# Altium schematic sheet MeteoStationNucleo.SchDoc
size A4
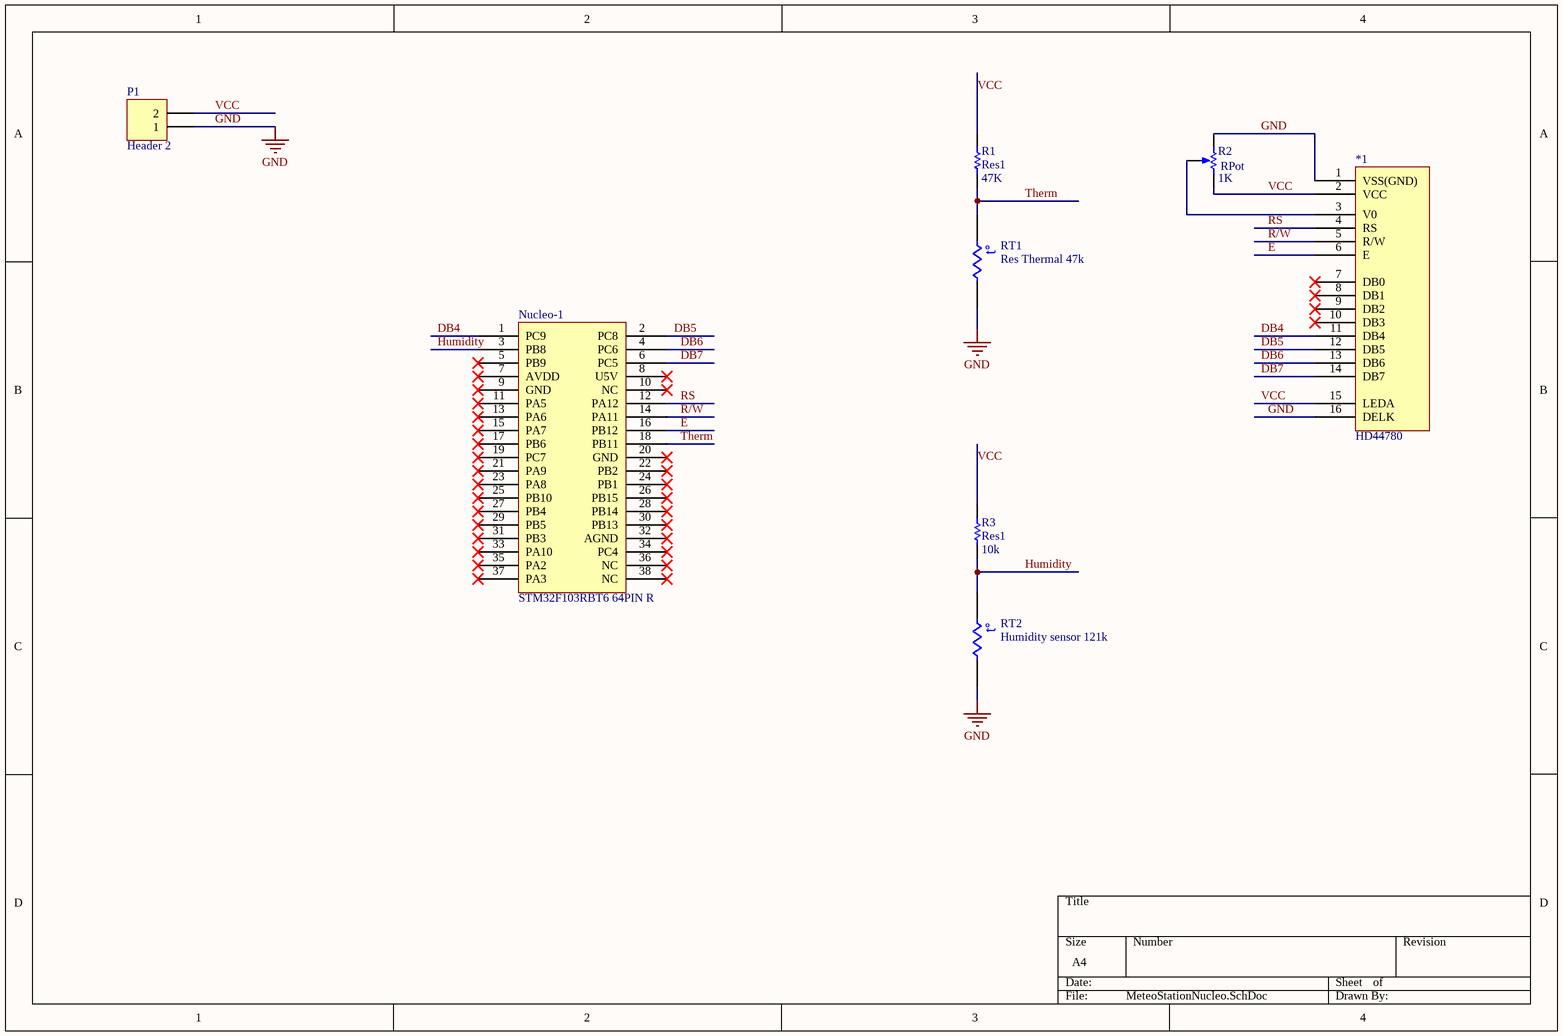
[diagram p0: MeteoStationNucleo.SchDoc]

## Parts
*1  HD44780
Nucleo-1  STM32F103RBT6 64PIN R
P1  Header 2  [HDR1X2]
R1  Res1  value 47K  [AXIAL-0.3]
R2  RPot  value 1K  [VR5]
R3  Res1  value 10k  [AXIAL-0.3]
RT1  Res Thermal 47k  [6-0805_N]
RT2  Humidity sensor 121k  [6-0805_N]

## Nets
GND: *1.1(VSS(GND)) *1.16(DELK) P1.1 R2.1(TOP) RT1.2 RT2.2
DB4: *1.11(DB4) Nucleo-1.1(PC9)
DB5: *1.12(DB5) Nucleo-1.2(PC8)
DB6: *1.13(DB6) Nucleo-1.4(PC6)
DB7: *1.14(DB7) Nucleo-1.6(PC5)
E: *1.6(E) Nucleo-1.16(PB12)
Humidity: Nucleo-1.3(PB8) R3.1 RT2.1
R/W: *1.5(R/W) Nucleo-1.14(PA11)
RS: *1.4(RS) Nucleo-1.12(PA12)
Therm: Nucleo-1.18(PB11) R1.1 RT1.1
VCC: *1.2(VCC) *1.15(LEDA) P1.2 R1.2 R2.2(BOT) R3.2
Net*1_3: *1.3(V0) R2.3(TAP)

Not connected (* = marked no-connect by the designer): *1 7(DB0)* 8(DB1)* 9(DB2)* 10(DB3)*; Nucleo-1 5(PB9)* 7(AVDD)* 8(U5V)* 9(GND)* 10(NC)* 11(PA5)* 13(PA6)* 15(PA7)* 17(PB6)* 19(PC7)* 20(GND)* 21(PA9)* 22(PB2)* 23(PA8)* 24(PB1)* 25(PB10)* 26(PB15)* 27(PB4)* 28(PB14)* 29(PB5)* 30(PB13)* 31(PB3)* 32(AGND)* 33(PA10)* 34(PC4)* 35(PA2)* 36(NC)* 37(PA3)* 38(NC)*

## Notes on the sheet
- (in symbol Res Thermal) t°

## Library data of the parts
Nucleo-1 = STM32F103RBT6 64PIN R: Right side
P1 = Header 2: Header, 2-Pin; LatestRevisionDate: 17-Jul-2002; LatestRevisionNote: Re-released for DXP Platform.; Publisher: Altium Limited
R1 R3 = Res1: Resistor; Published: 8-Jun-2000; LatestRevisionDate: 17-Jul-2002; LatestRevisionNote: Re-released for DXP Platform.; PackageReference: AXIAL-0.3; Publisher: Altium Limited; PackageDescription: Axial Device, Thru-Hole; 2 Leads; 0.3 in Pin Spacing
R2 = RPot: Potentiometer; Sim Note: Enter the Resistance value and the set point into parameter fields.; Set Position: 0.5; Published: 8-Jun-2000; LatestRevisionDate: 17-Jul-2002; LatestRevisionNote: Re-released for DXP Platform.; PackageReference: VR5; Publisher: Altium Limited; PackageDescription: Variable Resistor, Thru-Hole; 3 Leads
RT1 RT2 = Res Thermal: Thermistor; Published: 24-Mar-1999; LatestRevisionDate: 29-May-2009; LatestRevisionNote: IPC-7351 Footprint Added.; PackageVersion: Mar-2003; PackageReference: 6-0805; Publisher: Altium Limited; PackageDescription: Chip Resistor 0805 Case Size; Code_IPC: RESC2012